# EAGLE design 4x4-programmable-keypad (EAGLE 9.0.1)

## Sheet 1 of 2
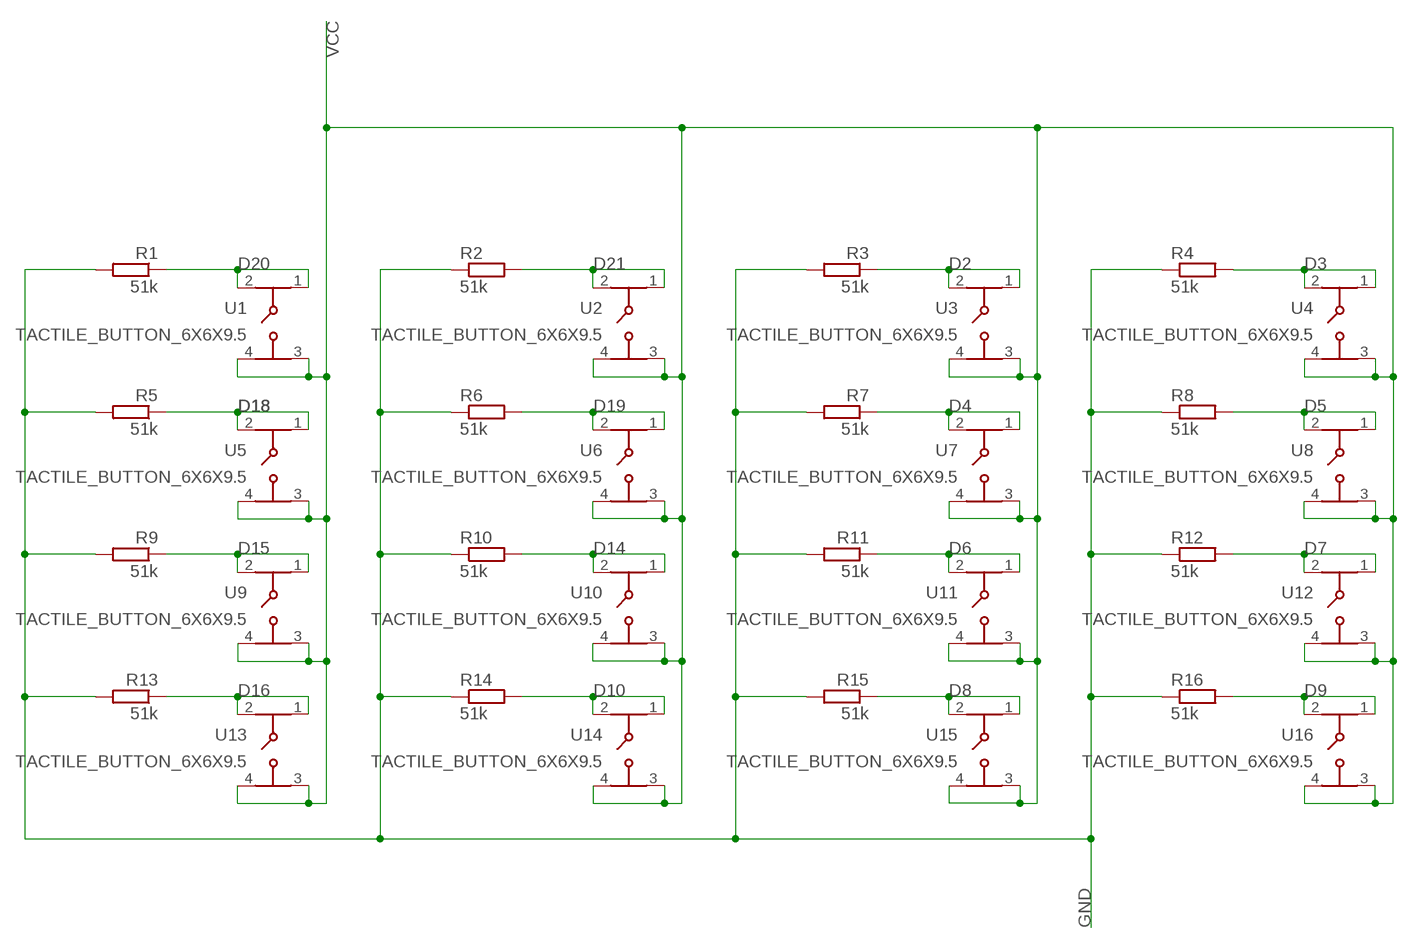
[diagram p0: schematic, sheet 1]

### Parts
R1  51k  R-EU_R0603  [R0603]
R2  51k  R-EU_R0603  [R0603]
R3  51k  R-EU_R0603  [R0603]
R4  51k  R-EU_R0603  [R0603]
R5  51k  R-EU_R0603  [R0603]
R6  51k  R-EU_R0603  [R0603]
R7  51k  R-EU_R0603  [R0603]
R8  51k  R-EU_R0603  [R0603]
R9  51k  R-EU_R0603  [R0603]
R10  51k  R-EU_R0603  [R0603]
R11  51k  R-EU_R0603  [R0603]
R12  51k  R-EU_R0603  [R0603]
R13  51k  R-EU_R0603  [R0603]
R14  51k  R-EU_R0603  [R0603]
R15  51k  R-EU_R0603  [R0603]
R16  51k  R-EU_R0603  [R0603]
U1  TACTILE_BUTTON_6X6X9.5  [TACTILE_SWITCH_PTH_6.0MM]
U2  TACTILE_BUTTON_6X6X9.5  [TACTILE_SWITCH_PTH_6.0MM]
U3  TACTILE_BUTTON_6X6X9.5  [TACTILE_SWITCH_PTH_6.0MM]
U4  TACTILE_BUTTON_6X6X9.5  [TACTILE_SWITCH_PTH_6.0MM]
U5  TACTILE_BUTTON_6X6X9.5  [TACTILE_SWITCH_PTH_6.0MM]
U6  TACTILE_BUTTON_6X6X9.5  [TACTILE_SWITCH_PTH_6.0MM]
U7  TACTILE_BUTTON_6X6X9.5  [TACTILE_SWITCH_PTH_6.0MM]
U8  TACTILE_BUTTON_6X6X9.5  [TACTILE_SWITCH_PTH_6.0MM]
U9  TACTILE_BUTTON_6X6X9.5  [TACTILE_SWITCH_PTH_6.0MM]
U10  TACTILE_BUTTON_6X6X9.5  [TACTILE_SWITCH_PTH_6.0MM]
U11  TACTILE_BUTTON_6X6X9.5  [TACTILE_SWITCH_PTH_6.0MM]
U12  TACTILE_BUTTON_6X6X9.5  [TACTILE_SWITCH_PTH_6.0MM]
U13  TACTILE_BUTTON_6X6X9.5  [TACTILE_SWITCH_PTH_6.0MM]
U14  TACTILE_BUTTON_6X6X9.5  [TACTILE_SWITCH_PTH_6.0MM]
U15  TACTILE_BUTTON_6X6X9.5  [TACTILE_SWITCH_PTH_6.0MM]
U16  TACTILE_BUTTON_6X6X9.5  [TACTILE_SWITCH_PTH_6.0MM]

### Nets
D2: R3.1 U3.1 U3.2 ; also sheet 2
D3: R4.2 U4.1 U4.2 ; also sheet 2
D4: R7.1 U7.1 U7.2 ; also sheet 2
D5: R8.2 U8.1 U8.2 ; also sheet 2
D6: R11.1 U11.1 U11.2 ; also sheet 2
D7: R12.2 U12.1 U12.2 ; also sheet 2
D8: R15.1 U15.1 U15.2 ; also sheet 2
D9: R16.2 U16.1 U16.2 ; also sheet 2
D10: R14.2 U14.1 U14.2 ; also sheet 2
D14: R10.2 U10.1 U10.2 ; also sheet 2
D15: R9.1 U9.1 U9.2 ; also sheet 2
D16: R13.1 U13.1 U13.2 ; also sheet 2
D18: R5.1 U5.1 U5.2 ; also sheet 2
D19: R6.2 U6.1 U6.2 ; also sheet 2
D20: R1.1 U1.1 U1.2 ; also sheet 2
D21: R2.2 U2.1 U2.2 ; also sheet 2
GND: R1.2 R2.1 R3.2 R4.1 R5.2 R6.1 R7.2 R8.1 R9.2 R10.1 R11.2 R12.1 R13.2 R14.1 R15.2 R16.1 ; also sheet 2
VCC: U1.3 U1.4 U2.3 U2.4 U3.3 U3.4 U4.3 U4.4 U5.3 U5.4 U6.3 U6.4 U7.3 U7.4 U8.3 U8.4 U9.3 U9.4 U10.3 U10.4 U11.3 U11.4 U12.3 U12.4 U13.3 U13.4 U14.3 U14.4 U15.3 U15.4 U16.3 U16.4 ; also sheet 2

## Sheet 2 of 2
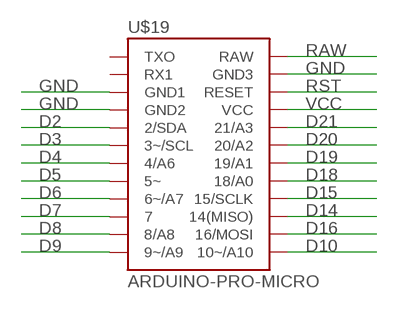
[diagram p1: schematic, sheet 2]

### Parts
U$19  ARDUINO-PRO-MICRO  [SPARKFUN_PRO_MICRO]

### Nets
D2: U$19.2/SDA ; also sheet 1
D3: U$19.3~/SCL ; also sheet 1
D4: U$19.4/A6 ; also sheet 1
D5: U$19.5~ ; also sheet 1
D6: U$19.6~/A7 ; also sheet 1
D7: U$19.7 ; also sheet 1
D8: U$19.8/A8 ; also sheet 1
D9: U$19.9~/A9 ; also sheet 1
D10: U$19.10~/A10 ; also sheet 1
D14: U$19.14/MISO(14(MISO)) ; also sheet 1
D15: U$19.15/SCLK ; also sheet 1
D16: U$19.16/MOSI ; also sheet 1
D18: U$19.18/A0 ; also sheet 1
D19: U$19.19/A1 ; also sheet 1
D20: U$19.20/A2 ; also sheet 1
D21: U$19.21/A3 ; also sheet 1
GND: U$19.GND1 U$19.GND2 U$19.GND3 ; also sheet 1
RAW: U$19.RAW
RST: U$19.RST(RESET)
VCC: U$19.VCC ; also sheet 1
Unconnected: U$19.RX1 U$19.TX0(TXO)

## Library data of the parts
R1-R16 = rcl:R-EU_: RESISTOR, European symbol; SPICEPREFIX: R
U1-U16 = Pat Sonstiges:TACTILE_BUTTON_6X6X9.5
U$19 = My Boards:ARDUINO-PRO-MICRO

## Board
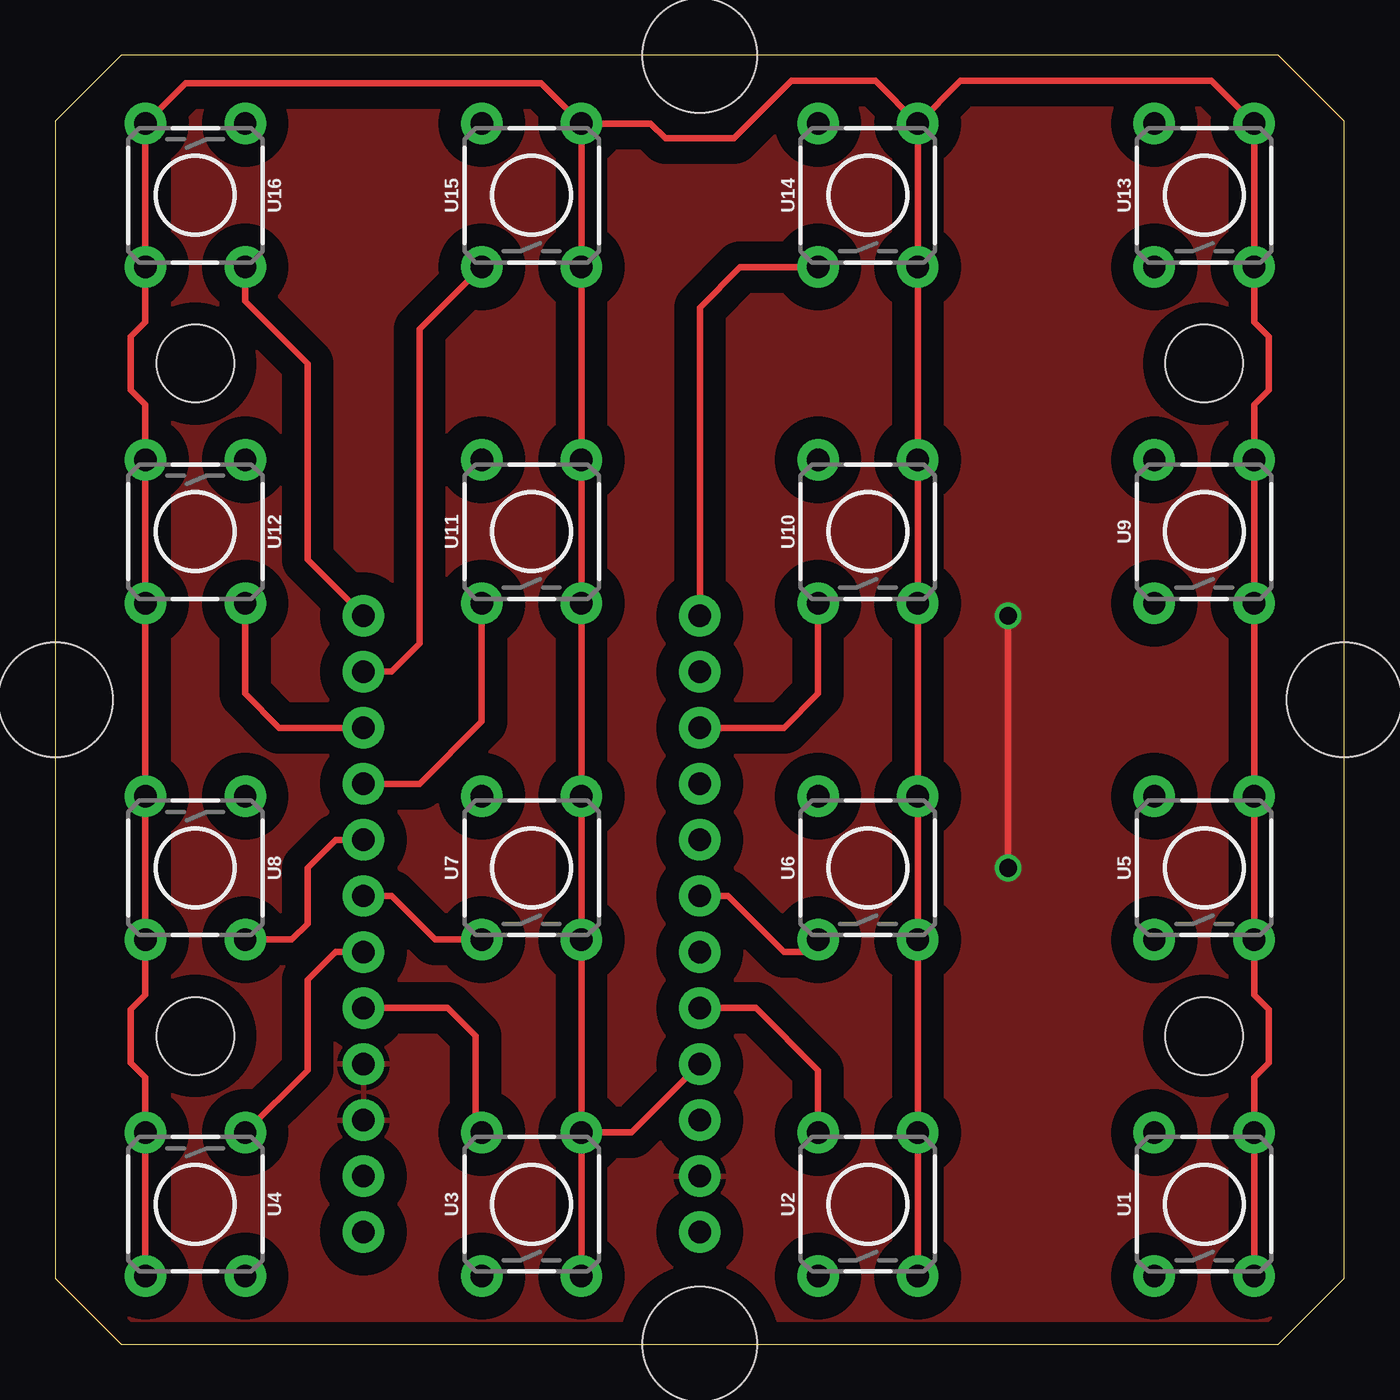
[diagram p2: board, top side]
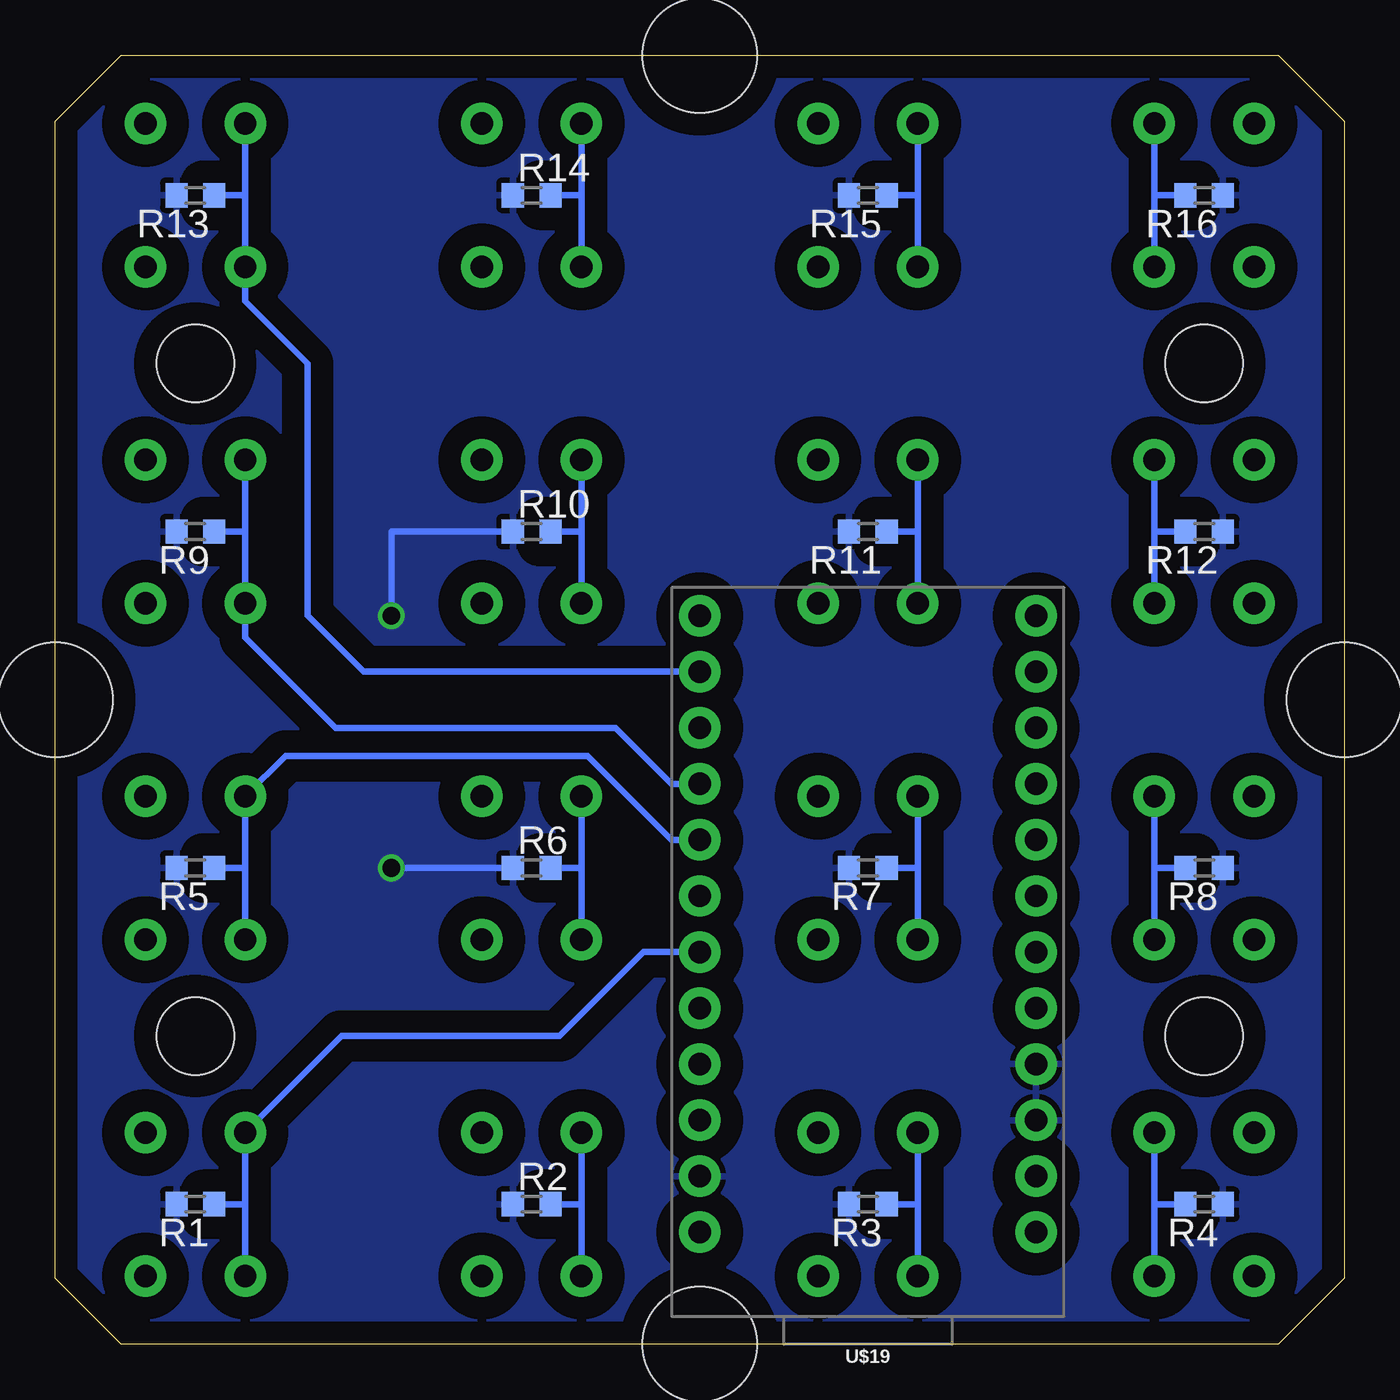
[diagram p3: board, bottom side, seen from below]

Size 58.42 x 58.42 mm. Coordinates in mm from the lower left corner, seen from the top.
Outline: 0,55.42 0,3 3,0 55.42,0 58.42,3 58.42,55.42 55.42,58.42 3,58.42 0,55.42
Copper layers (1*16): Top 0.035mm / dielectric 1.5mm / Bottom 0.035mm
Design rules "default *": minimum track width 6mil, minimum drill 0.35mm, track to track 6mil, track to pad 6mil, pad to pad 6mil, via to via 6mil, smd to smd 6mil, copper to edge 40mil, drill to drill 6mil, minimum pad ring 10mil, minimum via ring 8mil, stop-mask expansion 4mil, vias tented up to drill 0mil, thermal gap 10mil
Holes 3.5 mm at 6.35,44.45 52.07,44.45 6.35,13.97 52.07,13.97
Holes 5.2 mm at 29.21,58.42 58.42,29.21 0,29.21 29.21,0

### Footprints (pad centres in the part's own frame; a part is rotated, then mirrored left to right if it is on the bottom)
R0603 = smd 1 x 1.1: 1 -0.85,0; 2 0.85,0
TACTILE_SWITCH_PTH_6.0MM = drill 1.016 pad 1.88: 1 -3.251,2.261; 2 3.251,2.261; 3 -3.251,-2.261; 4 3.251,-2.261
SPARKFUN_PRO_MICRO = drill 1.016 pad 1.88: 2/SDA -7.62,2.54; 3~/SCL -7.62,0; 4/A6 -7.62,-2.54; 5~ -7.62,-5.08; 6~/A7 -7.62,-7.62; 7 -7.62,-10.16; 8/A8 -7.62,-12.7; 9~/A9 -7.62,-15.24; 10~/A10 7.62,-15.24; 14/MISO 7.62,-10.16; 15/SCLK 7.62,-7.62; 16/MOSI 7.62,-12.7; 18/A0 7.62,-5.08; 19/A1 7.62,-2.54; 20/A2 7.62,0; 21/A3 7.62,2.54; GND1 -7.62,7.62; GND2 -7.62,5.08; GND3 7.62,10.16; RAW 7.62,12.7; RST 7.62,7.62; RX1 -7.62,10.16; TX0 -7.62,12.7; VCC 7.62,5.08

### Placement (x,y rotation side)
R1  52.07,6.35 180 bottom
R2  36.83,6.35 0 bottom
R3  21.59,6.35 180 bottom
R4  6.35,6.35 180 bottom
R5  52.07,21.59 180 bottom
R6  36.83,21.59 0 bottom
R7  21.59,21.59 180 bottom
R8  6.35,21.59 180 bottom
R9  52.07,36.83 180 bottom
R10  36.83,36.83 0 bottom
R11  21.59,36.83 180 bottom
R12  6.35,36.83 180 bottom
R13  52.07,52.07 180 bottom
R14  36.83,52.07 0 bottom
R15  21.59,52.07 180 bottom
R16  6.35,52.07 180 bottom
U1  52.07,6.35 90 top
U2  36.83,6.35 90 top
U3  21.59,6.35 90 top
U4  6.35,6.35 270 top
U5  52.07,21.59 90 top
U6  36.83,21.59 90 top
U7  21.59,21.59 90 top
U8  6.35,21.59 270 top
U9  52.07,36.83 90 top
U10  36.83,36.83 90 top
U11  21.59,36.83 90 top
U12  6.35,36.83 270 top
U13  52.07,52.07 90 top
U14  36.83,52.07 90 top
U15  21.59,52.07 90 top
U16  6.35,52.07 270 top
U$19  21.59,17.78 180 bottom

### Tracks (layer width: path | path; a pad name or v marks a point on that pad's centre or on a via)
D2
  Top 0.305: U3.2 19.05,9.88 19.05,13.97 17.78,15.24 U$19.2/SDA
  Bottom 0.305: U3.1 19.33,6.35 | 19.33,6.35 U3.2 | R3.1 19.33,6.35
D3
  Top 0.305: U4.1 11.43,12.42 11.43,16.51 12.7,17.78 U$19.3~/SCL
  Bottom 0.305: U4.2 8.61,6.35 | 8.61,6.35 U4.1 | R4.2 8.61,6.35
D4
  Top 0.305: U7.1 17.22,18.34 15.24,20.32 U$19.4/A6
  Bottom 0.305: U7.1 19.33,21.59 | 19.33,21.59 U7.2 | R7.1 19.33,21.59
D5
  Top 0.305: U8.2 10.72,18.34 11.43,19.05 11.43,21.59 12.7,22.86 U$19.5~
  Bottom 0.305: U8.1 8.61,21.59 | 8.61,21.59 U8.2 | R8.2 8.61,21.59
D6
  Top 0.305: U$19.6~/A7 16.51,25.4 19.33,28.22 U11.1
  Bottom 0.305: U11.1 19.33,36.83 | 19.33,36.83 U11.2 | R11.1 19.33,36.83
D7
  Top 0.305: U$19.7 10.16,27.94 8.61,29.49 U12.2
  Bottom 0.305: U12.1 8.61,36.83 | 8.61,36.83 U12.2 | R12.2 8.61,36.83
D8
  Top 0.305: U$19.8/A8 15.24,30.48 16.51,31.75 16.51,46 U15.1
  Bottom 0.305: U15.1 19.33,52.07 | 19.33,52.07 U15.2 | R15.1 19.33,52.07
D9
  Top 0.305: U$19.9~/A9 11.43,35.56 11.43,44.45 8.61,47.27 U16.2
  Bottom 0.305: U16.1 8.61,52.07 | 8.61,52.07 U16.2 | R16.2 8.61,52.07
D10
  Top 0.305: U14.1 31.04,48.82 29.21,46.99 U$19.10~/A10
  Bottom 0.305: U14.1 34.57,52.07 | 34.57,52.07 U14.2 | R14.2 34.57,52.07
D14
  Top 0.305: U10.1 34.57,29.49 33.02,27.94 U$19.14/MISO
  Bottom 0.305: U10.1 34.57,36.83 | 34.57,36.83 U10.2 | R10.2 34.57,36.83
D15
  Bottom 0.305: 49.81,36.83 49.81,34.29 U9.1 49.81,32.03 45.72,27.94 33.02,27.94 30.48,25.4 U$19.15/SCLK | 49.81,36.83 U9.2 | R9.1 49.81,36.83
D16
  Bottom 0.305: 49.81,52.07 U13.1 49.81,47.27 46.99,44.45 46.99,33.02 44.45,30.48 U$19.16/MOSI | 49.81,52.07 U13.2 | R13.1 49.81,52.07
D18
  Bottom 0.305: U5.1 49.81,21.59 | 49.81,21.59 U5.2 47.98,26.67 34.29,26.67 30.48,22.86 U$19.18/A0 | R5.1 49.81,21.59
D19
  Top 0.305: U6.1 34.29,18.06 34.29,17.78 33.02,17.78 30.48,20.32 U$19.19/A1
  Bottom 0.305: U6.1 34.57,21.59 | 34.57,21.59 U6.2 | R6.2 34.57,21.59
D20
  Bottom 0.305: U1.1 49.81,6.35 | 49.81,6.35 U1.2 45.44,13.97 35.56,13.97 31.75,17.78 U$19.20/A2 | R1.1 49.81,6.35
D21
  Top 0.305: U2.2 34.57,12.42 31.75,15.24 U$19.21/A3
  Bottom 0.305: U2.1 34.57,6.35 | 34.57,6.35 U2.2 | R2.2 34.57,6.35
GND  (via drill 0.8)
  Top 0.305: v43.18,33.02 v43.18,21.59
  Bottom 0.305: 41.91,36.83 R10.1 43.18,36.83 v43.18,33.02 | v43.18,21.59 R6.1
  pour Top (isolate 1.016): 0,0 0,58.42 58.42,58.42 58.42,0
  pour Bottom (isolate 1.016): 0,0 58.42,0 58.42,58.42 0,58.42
  pour Bottom (isolate 1.016): 0,0 0,58.42 58.42,58.42 58.42,0
VCC
  Top 0.305: U3.3 U3.4 | U3.4 U7.3 U7.4 U11.3 U11.4 U15.3 U15.4 | U15.4 22.02,57.15 5.92,57.15 U16.3 U16.4 4.09,46.32 3.43,45.66 3.43,43.24 4.09,42.58 U12.3 U12.4 U8.3 U8.4 4.09,15.84 3.43,15.18 3.43,12.76 4.09,12.1 U4.3 U4.4 | U14.4 U14.3 U10.4 U10.3 U6.4 U6.3 U2.4 U2.3 | U14.4 37.16,57.25 33.37,57.25 30.77,54.65 27.65,54.65 26.98,55.32 U15.4 | U14.4 41.02,57.25 52.4,57.25 U13.4 U13.3 54.33,46.32 54.99,45.66 54.99,43.24 54.33,42.58 U9.4 U9.3 U5.4 U5.3 54.33,15.84 54.99,15.18 54.99,12.76 54.33,12.1 U1.4 U1.3 | U$19.VCC 26.11,9.6 U3.4